# Altium schematic sheet Esquematico.SchDoc
size A4; SheetNumber: 1; SheetTotal: 1
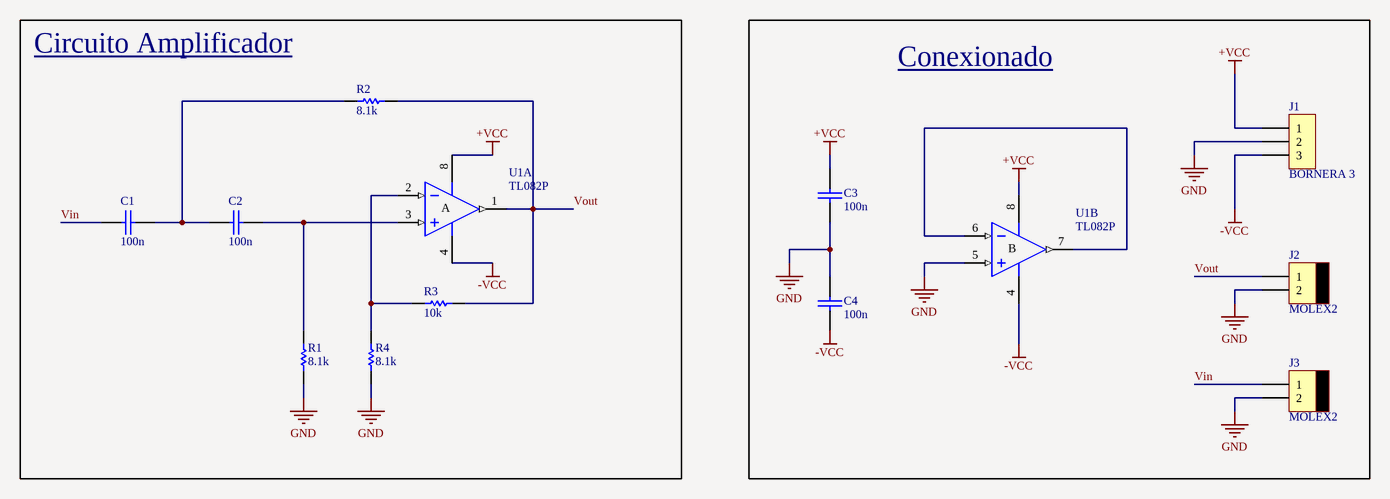
[diagram p0: Esquematico.SchDoc]

## Parts
C1  100n  [CAP200]
C2  100n  [CAP200]
C3  100n  [CAP200]
C4  100n  [CAP200]
J1  BORNERA 3  [BORNERA3]
J2  MOLEX2  [MOLEX2]
J3  MOLEX2  [MOLEX2]
R1  8.1k  [RES400]
R2  8.1k  [RES400]
R3  10k  [RES400]
R4  8.1k  [RES400]
U1  TL082P  [P008]  (parts A,B of 2)

## Blocks framed on the sheet
Circuito Amplificador: C1 C2 R1-R4 U1
Conexionado: C3 C4 J1-J3 U1

## Nets
+VCC: C3.2 J1.1 U1.8(V+)
-VCC: C4.1 J1.3 U1.4(V-)
GND: C3.1 C4.2 J1.2 J2.2 J3.2 R1.1 R4.1 U1.5(IN+)
Vin: C1.1 J3.1
Vout: J2.1 R2.1 R3.1 U1.1(OUT)
NetC1_2: C1.2 C2.1 R2.2
NetC2_2: C2.2 R1.2 U1.3(IN+)
NetR3_2: R3.2 R4.2 U1.2(IN-)
NetU1_6: U1.6(IN-) U1.7(OUT)

## Notes on the sheet
- (in symbol TL082P, part A) A
- (in symbol TL082P, part B) B

## Library data of the parts
C1-C4 = CAP
R1-R4 = RES
U1 = TL082P: JFET-Input Operational Amplifier; Published: 16-Jan-2001; LatestRevisionDate: 04-Mar-2005; LatestRevisionNote: Stylized 3D Model Added.; DatasheetVersion: Feb-1999; PackageVersion: Jun-1999; PackageReference: P008; Publisher: Altium Limited; PackageDescription: DIP; 8 Leads; Row Spacing 7.62 mm; Pitch 2.54 mm; Code_JEDEC: MO-001-AN; ComponentLink1Description: Manufacturer Link; ComponentLink1URL: http://www.ti.com/; ComponentLink2Description: Datasheet; ComponentLink2URL: http://www-s.ti.com/sc/ds/tl082.pdf